# EAGLE design backplane (EAGLE 9.4.2)
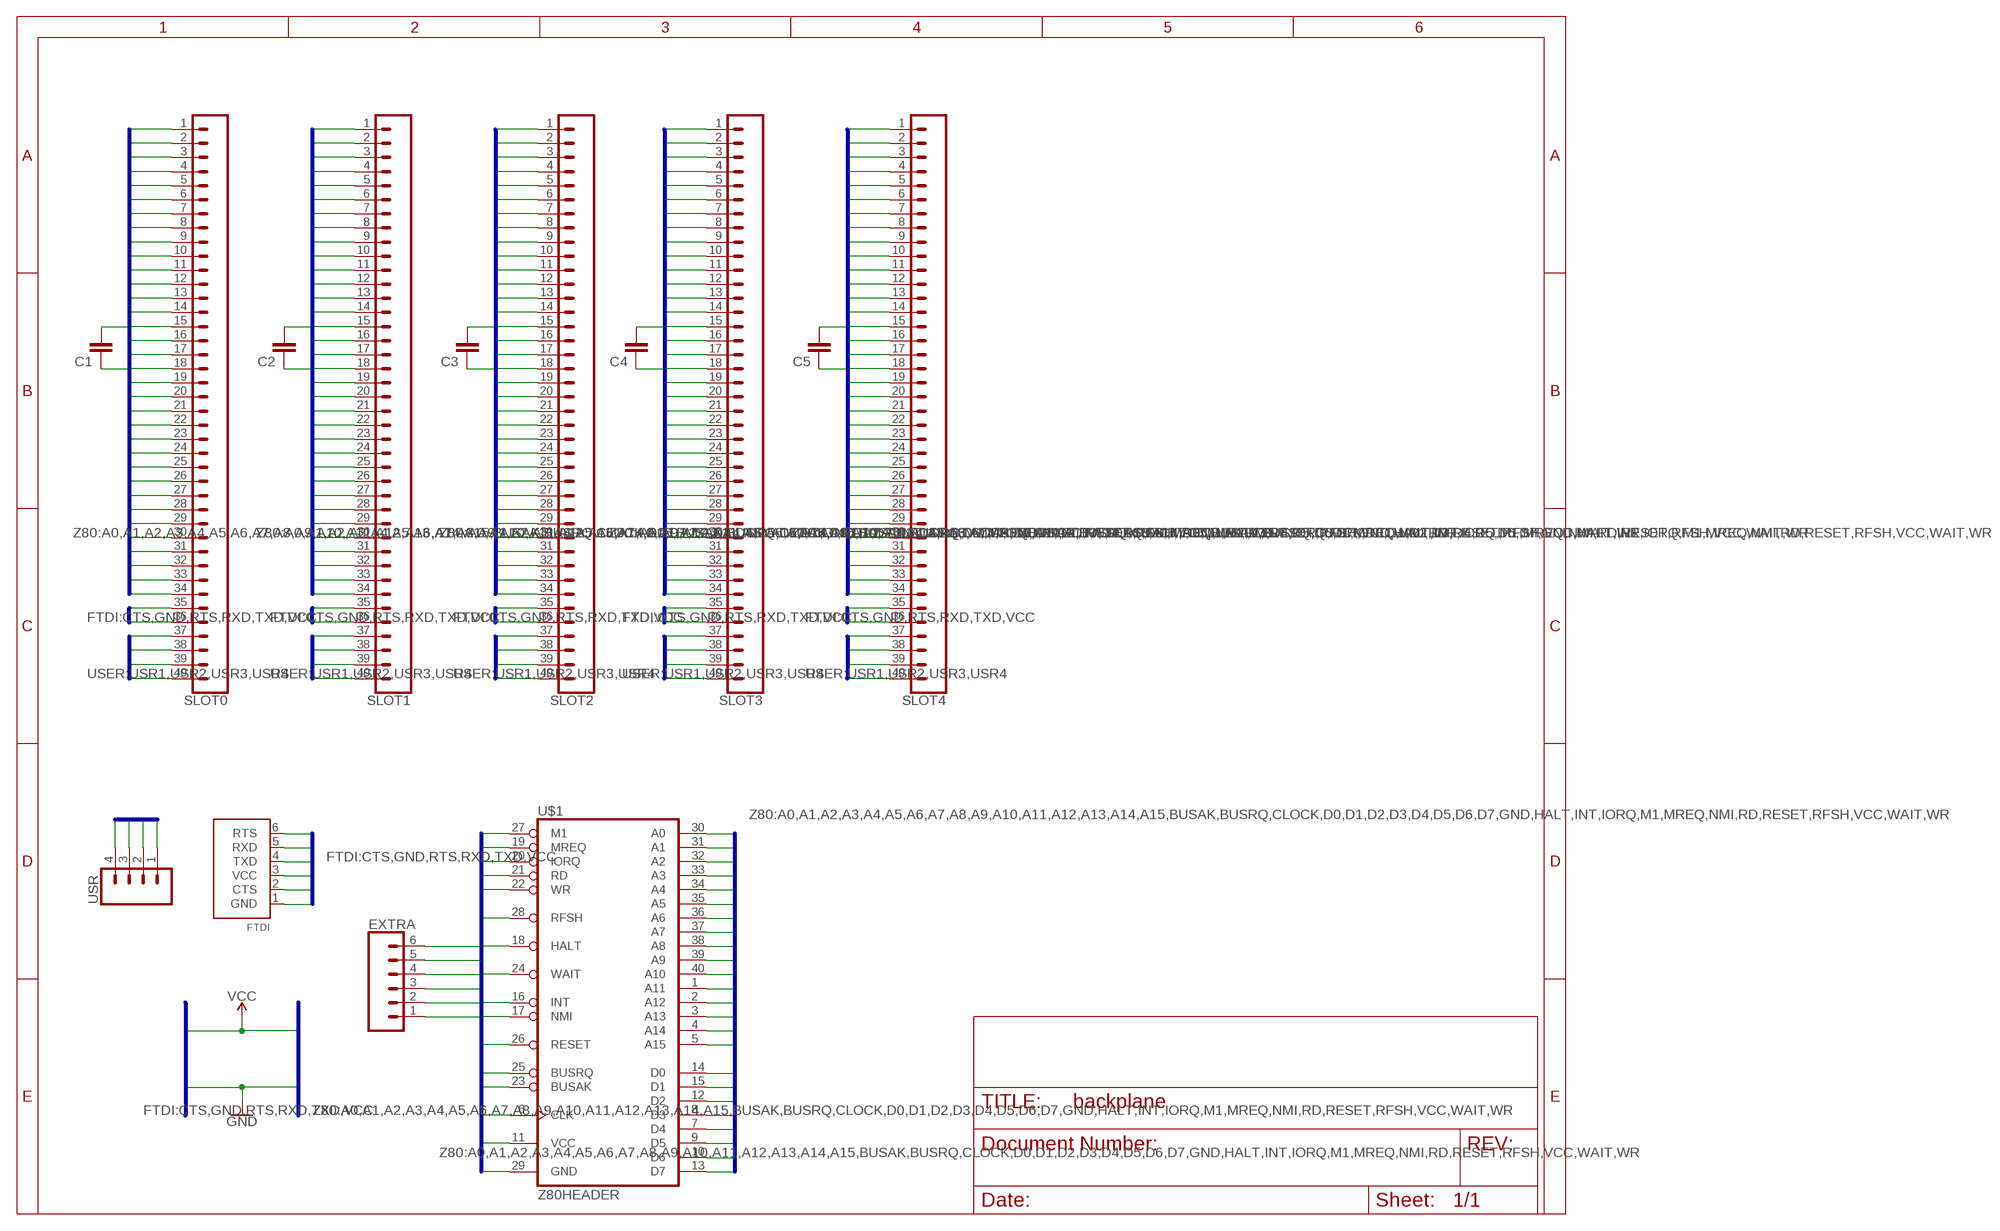
[diagram p0: schematic, sheet 1]

## Parts
C1  C2,5-3  [C2.5-3]
C2  C2,5-3  [C2.5-3]
C3  C2,5-3  [C2.5-3]
C4  C2,5-3  [C2.5-3]
C5  C2,5-3  [C2.5-3]
EXTRA  CONN_06LOCK  [1X06_LOCK]
FTDI  FTDIUSBCABLE  [1X06_ROUND]
SLOT0  CONN_40  [1X40]
SLOT1  CONN_40  [1X40]
SLOT2  CONN_40  [1X40]
SLOT3  CONN_40  [1X40]
SLOT4  CONN_40  [1X40]
U$1  Z80HEADER  [2X20]
USR  CONN_04PTH  [1X04]

## Nets
A0: SLOT0.16 SLOT1.16 SLOT2.16 SLOT3.16 SLOT4.16 U$1.30(A0)
A1: SLOT0.15 SLOT1.15 SLOT2.15 SLOT3.15 SLOT4.15 U$1.31(A1)
A2: SLOT0.14 SLOT1.14 SLOT2.14 SLOT3.14 SLOT4.14 U$1.32(A2)
A3: SLOT0.13 SLOT1.13 SLOT2.13 SLOT3.13 SLOT4.13 U$1.33(A3)
A4: SLOT0.12 SLOT1.12 SLOT2.12 SLOT3.12 SLOT4.12 U$1.34(A4)
A5: SLOT0.11 SLOT1.11 SLOT2.11 SLOT3.11 SLOT4.11 U$1.35(A5)
A6: SLOT0.10 SLOT1.10 SLOT2.10 SLOT3.10 SLOT4.10 U$1.36(A6)
A7: SLOT0.9 SLOT1.9 SLOT2.9 SLOT3.9 SLOT4.9 U$1.37(A7)
A8: SLOT0.8 SLOT1.8 SLOT2.8 SLOT3.8 SLOT4.8 U$1.38(A8)
A9: SLOT0.7 SLOT1.7 SLOT2.7 SLOT3.7 SLOT4.7 U$1.39(A9)
A10: SLOT0.6 SLOT1.6 SLOT2.6 SLOT3.6 SLOT4.6 U$1.40(A10)
A11: SLOT0.5 SLOT1.5 SLOT2.5 SLOT3.5 SLOT4.5 U$1.1(A11)
A12: SLOT0.4 SLOT1.4 SLOT2.4 SLOT3.4 SLOT4.4 U$1.2(A12)
A13: SLOT0.3 SLOT1.3 SLOT2.3 SLOT3.3 SLOT4.3 U$1.3(A13)
A14: SLOT0.2 SLOT1.2 SLOT2.2 SLOT3.2 SLOT4.2 U$1.4(A14)
A15: SLOT0.1 SLOT1.1 SLOT2.1 SLOT3.1 SLOT4.1 U$1.5(A15)
BUSAK: EXTRA.6 U$1.23(BUSAK)
BUSRQ: EXTRA.5 U$1.25(BUSRQ)
CLOCK: SLOT0.21 SLOT1.21 SLOT2.21 SLOT3.21 SLOT4.21 U$1.6(CLK)
CTS: FTDI.2(CTS)
D0: SLOT0.27 SLOT1.27 SLOT2.27 SLOT3.27 SLOT4.27 U$1.14(D0)
D1: SLOT0.28 SLOT1.28 SLOT2.28 SLOT3.28 SLOT4.28 U$1.15(D1)
D2: SLOT0.29 SLOT1.29 SLOT2.29 SLOT3.29 SLOT4.29 U$1.12(D2)
D3: SLOT0.30 SLOT1.30 SLOT2.30 SLOT3.30 SLOT4.30 U$1.8(D3)
D4: SLOT0.31 SLOT1.31 SLOT2.31 SLOT3.31 SLOT4.31 U$1.7(D4)
D5: SLOT0.32 SLOT1.32 SLOT2.32 SLOT3.32 SLOT4.32 U$1.9(D5)
D6: SLOT0.33 SLOT1.33 SLOT2.33 SLOT3.33 SLOT4.33 U$1.10(D6)
D7: SLOT0.34 SLOT1.34 SLOT2.34 SLOT3.34 SLOT4.34 U$1.13(D7)
GND: C1.1 C2.1 C3.1 C4.1 C5.1 FTDI.1(GND) SLOT0.17 SLOT1.17 SLOT2.17 SLOT3.17 SLOT4.17 U$1.29(GND)
HALT: EXTRA.3 U$1.18(HALT)
INT: SLOT0.22 SLOT1.22 SLOT2.22 SLOT3.22 SLOT4.22 U$1.16(INT)
IORQ: SLOT0.26 SLOT1.26 SLOT2.26 SLOT3.26 SLOT4.26 U$1.20(IORQ)
M1: SLOT0.19 SLOT1.19 SLOT2.19 SLOT3.19 SLOT4.19 U$1.27(M1)
MREQ: SLOT0.23 SLOT1.23 SLOT2.23 SLOT3.23 SLOT4.23 U$1.19(MREQ)
NMI: EXTRA.2 U$1.17(NMI)
RD: SLOT0.25 SLOT1.25 SLOT2.25 SLOT3.25 SLOT4.25 U$1.21(RD)
RESET: SLOT0.20 SLOT1.20 SLOT2.20 SLOT3.20 SLOT4.20 U$1.26(RESET)
RFSH: EXTRA.1 U$1.28(RFSH)
RTS: FTDI.6(RTS)
RXD: FTDI.5(RXD) SLOT0.36 SLOT1.36 SLOT2.36 SLOT3.36 SLOT4.36
TXD: FTDI.4(TXD) SLOT0.35 SLOT1.35 SLOT2.35 SLOT3.35 SLOT4.35
USR1: SLOT0.37 SLOT1.37 SLOT2.37 SLOT3.37 SLOT4.37 USR.1
USR2: SLOT0.38 SLOT1.38 SLOT2.38 SLOT3.38 SLOT4.38 USR.2
USR3: SLOT0.39 SLOT1.39 SLOT2.39 SLOT3.39 SLOT4.39 USR.3
USR4: SLOT0.40 SLOT1.40 SLOT2.40 SLOT3.40 SLOT4.40 USR.4
VCC: C1.2 C2.2 C3.2 C4.2 C5.2 FTDI.3(VCC) SLOT0.18 SLOT1.18 SLOT2.18 SLOT3.18 SLOT4.18 U$1.11(VCC)
WAIT: EXTRA.4 U$1.24(WAIT)
WR: SLOT0.24 SLOT1.24 SLOT2.24 SLOT3.24 SLOT4.24 U$1.22(WR)

## Buses
Z80:A0,A1,A2,A3,A4,A5,A6,A7,A8,A9,A10,A11,A12,A13,A14,A15,BUSAK,BUSRQ,CLOCK,D0,D1,D2,D3,D4,D5,D6,D7,GND,HALT,INT,IORQ,M1,MREQ,NMI,RD,RESET,RFSH,VCC,WAIT,WR
FTDI:CTS,GND,RTS,RXD,TXD,VCC
USER:USR1,USR2,USR3,USR4

## Library data of the parts
C1-C5 = capacitor-wima:C: CAPACITOR naming: grid - package width
EXTRA = SparkFun-Connectors:CONN_06: Multi connection point. Often used as Generic Header-pin footprint for 0.1 inch spaced/style header connections On any of the 0.1 inch spaced packages, you can populate with these: Break Away Headers - Straight <https://www.sparkfun.com/products/116> (PRT-00116) Break Away Male Headers - Right Angle <https://www.sparkfun.com/products/553> (PRT-00553) Female Headers <https://www.sparkfun.com/products/115> (PRT-00115) Break Away Headers - Machine Pin <https://www.sparkfun.com/products/117> (PRT-00117) Break Away Female Headers - Swiss Machine Pin <https://www.sparkfun.com/products/743> (PRT-00743) Arduino Stackable Header - 6 Pin <https://www.sparkfun.com/products/9280> (PRT-09280) For SCREWTERMINALS and SPRING TERMINALS visit here: Screw Terimnals on SparkFun.com <https://www.sparkfun.com/search/results?term=Screw+Terminals> (5mm/3.5mm/2.54mm spacing) This device is also useful as a general connection point to wire up your design to another part of your project. Our various solder wires solder well into these plated through hole pads. Hook-Up Wire - Assortment (Stranded, 22 AWG) <https://www.sparkfun.com/products/11375> (PRT-11375) Hook-Up Wire - Assortment (Solid Core, 22 AWG) <https://www.sparkfun.com/products/11367> (PRT-11367) View the entire wire category on our website here <https://www.sparkfun.com/categories/141>
FTDI = microbuilder:FTDIUSBCABLE: FTDI TTL-232R USB Cable Connector for FTDI's USB->RS232 Cable
SLOT0 SLOT1-SLOT4 = SparkFun-Connectors:CONN_40: Multi connection point. Often used as Generic Header-pin footprint for 0.1 inch spaced/style header connections On any of the 0.1 inch spaced packages, you can populate with these: Break Away Headers - Straight <https://www.sparkfun.com/products/116> (PRT-00116) Break Away Male Headers - Right Angle <https://www.sparkfun.com/products/553> (PRT-00553) Female Headers <https://www.sparkfun.com/products/115> (PRT-00115) Break Away Headers - Machine Pin <https://www.sparkfun.com/products/117> (PRT-00117) Break Away Female Headers - Swiss Machine Pin <https://www.sparkfun.com/products/743> (PRT-00743) For SCREWTERMINALS and SPRING TERMINALS visit here: Screw Terimnals on SparkFun.com <https://www.sparkfun.com/search/results?term=Screw+Terminals> (5mm/3.5mm/2.54mm spacing) This device is also useful as a general connection point to wire up your design to another part of your project. Our various solder wires solder well into these plated through hole pads. Hook-Up Wire - Assortment (Stranded, 22 AWG) <https://www.sparkfun.com/products/11375> (PRT-11375) Hook-Up Wire - Assortment (Solid Core, 22 AWG) <https://www.sparkfun.com/products/11367> (PRT-11367) View the entire wire category on our website here <https://www.sparkfun.com/categories/141> Special notes: Molex polarized connector foot print use with SKU : PRT-08231 with associated crimp pins and housings. 1MM SMD Version SKU: PRT-10208 NOTES ON THE VARIANTS LOCK and LOCK_LONGPADS... This footprint was designed to help hold the alignment of a through-hole component (i.e. 6-pin header) while soldering it into place. You may notice that each hole has been shifted either up or down by 0.005 of an inch from it's more standard position (which is a perfectly straight line). This slight alteration caused the pins (the squares in the middle) to touch the edges of the holes. Because they are alternating, it causes a "brace" to hold the component in place. 0.005 has proven to be the perfect amount of "off-center" position when using our standard breakaway headers. Although looks a little odd when you look at the bare footprint, once you have a header in there, the alteration is very hard to notice. Also,if you push a header all the way into place, it is covered up entirely on the bottom side.
U$1 = wntrmute:Z80
USR = SparkFun-Connectors:CONN_04: Multi connection point. Often used as Generic Header-pin footprint for 0.1 inch spaced/style header connections On any of the 0.1 inch spaced packages, you can populate with these: Break Away Headers - Straight <https://www.sparkfun.com/products/116> (PRT-00116) Break Away Male Headers - Right Angle <https://www.sparkfun.com/products/553> (PRT-00553) Female Headers <https://www.sparkfun.com/products/115> (PRT-00115) Break Away Headers - Machine Pin <https://www.sparkfun.com/products/117> (PRT-00117) Break Away Female Headers - Swiss Machine Pin <https://www.sparkfun.com/products/743> (PRT-00743) For SCREWTERMINALS and SPRING TERMINALS visit here: Screw Terimnals on SparkFun.com <https://www.sparkfun.com/search/results?term=Screw+Terminals> (5mm/3.5mm/2.54mm spacing) This device is also useful as a general connection point to wire up your design to another part of your project. Our various solder wires solder well into these plated through hole pads. Hook-Up Wire - Assortment (Stranded, 22 AWG) <https://www.sparkfun.com/products/11375> (PRT-11375) Hook-Up Wire - Assortment (Solid Core, 22 AWG) <https://www.sparkfun.com/products/11367> (PRT-11367) View the entire wire category on our website here <https://www.sparkfun.com/categories/141> Special notes: Molex polarized connector foot print use with SKU : PRT-08231 with associated crimp pins and housings. 1MM SMD Version SKU: PRT-10208; PROD_ID: CONN-09696

## Net classes
0 default: width 0.152 mm, drill 0.254 mm, clearance 0.152 mm

## Board
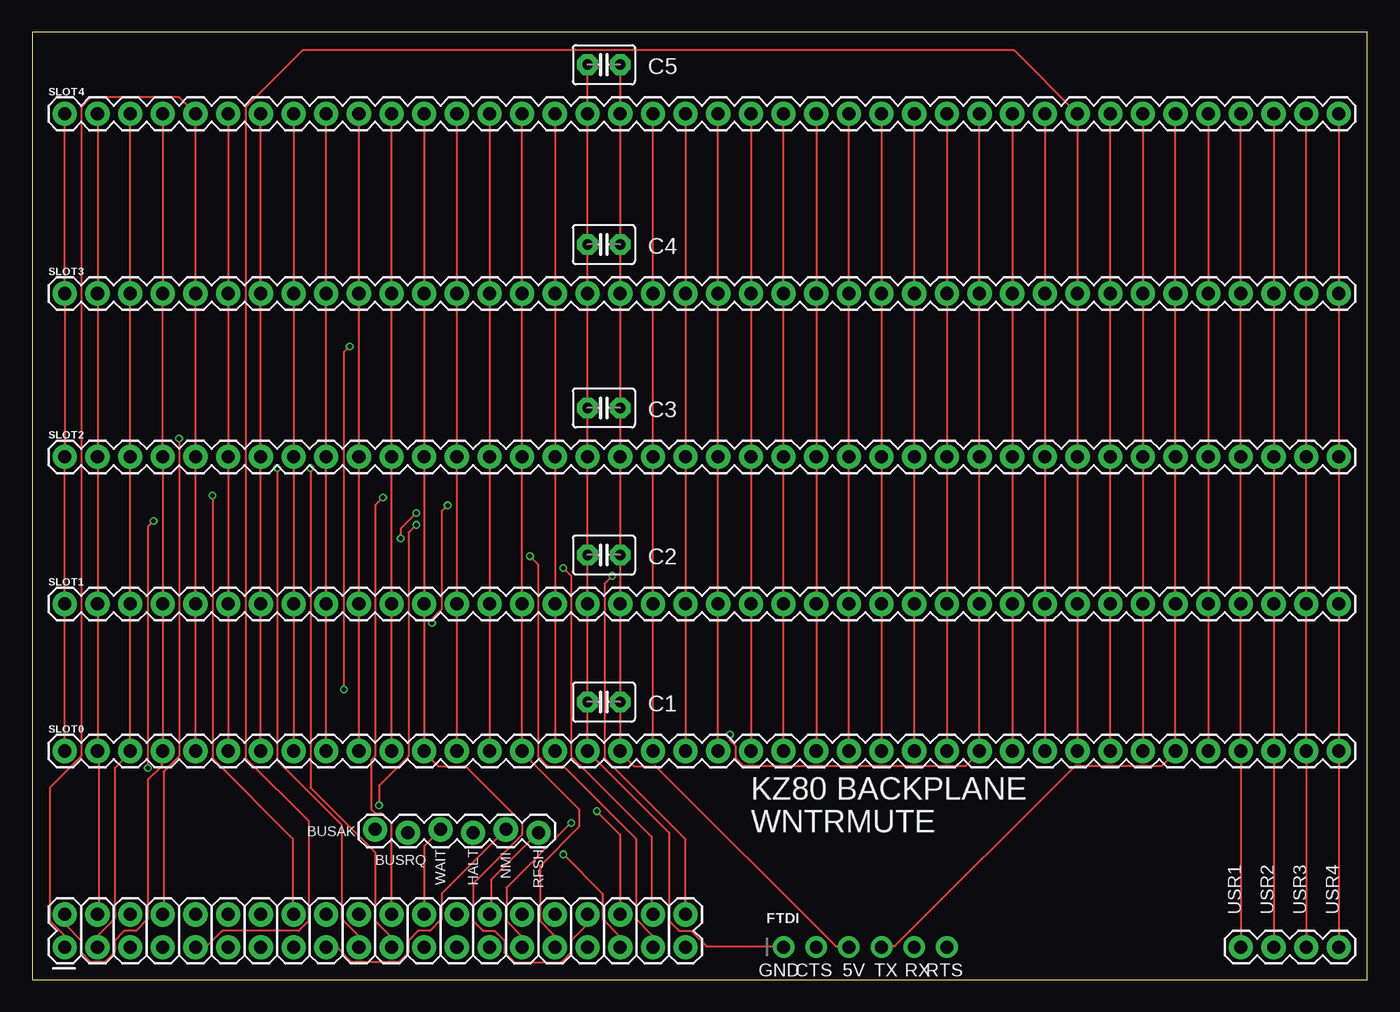
[diagram p1: board, top side]
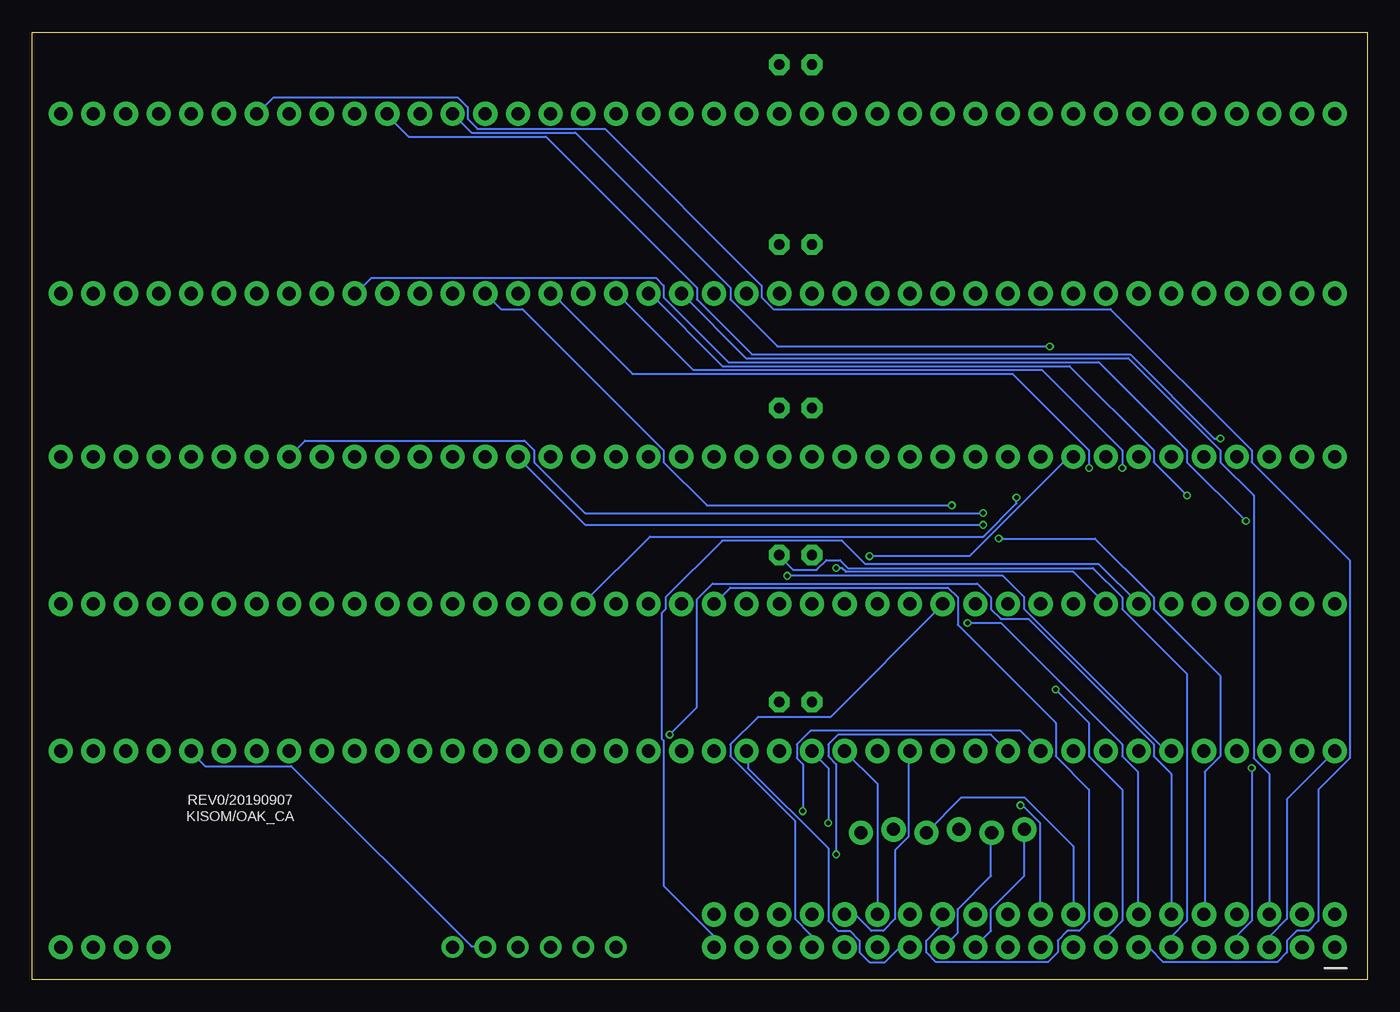
[diagram p2: board, bottom side, seen from below]

Size 103.81 x 73.65 mm. Coordinates in mm from the lower left corner, seen from the top.
Outline: 0,0 103.81,0 103.81,73.65 0,73.65 0,0
Copper layers (1*16): Top 0.035559375mm / dielectric 1.6mm / Bottom 0.035559375mm
Design rules "oshpark-2layer": minimum track width 6mil, minimum drill 10mil, track to track 6mil, track to pad 6mil, pad to pad 6mil, via to via 6mil, smd to smd 6mil, copper to edge 15mil, drill to drill 6mil, minimum pad ring 5mil, minimum via ring 5mil, stop-mask expansion 2.5mil, vias tented up to drill 0mil, thermal gap 10mil

### Footprints (pad centres in the part's own frame; a part is rotated, then mirrored left to right if it is on the bottom)
C2.5-3 = drill 0.813 pad 1.6 octagon: 1 -1.27,0; 2 1.27,0
1X06_LOCK = drill 1.016 pad 1.88: 1 0,0; 2 2.54,-0.254; 3 5.08,0; 4 7.62,-0.254; 5 10.16,0; 6 12.7,-0.254
1X06_ROUND = drill 1 pad 1.676: 1 -6.35,0; 2 -3.81,0; 3 -1.27,0; 4 1.27,0; 5 3.81,0; 6 6.35,0
1X40 = drill 1.016 pad 1.88: 1 0,0; 2 2.54,0; 3 5.08,0; 4 7.62,0; 5 10.16,0; 6 12.7,0; 7 15.24,0; 8 17.78,0; 9 20.32,0; 10 22.86,0; 11 25.4,0; 12 27.94,0; 13 30.48,0; 14 33.02,0; 15 35.56,0; 16 38.1,0; 17 40.64,0; 18 43.18,0; 19 45.72,0; 20 48.26,0; 21 50.8,0; 22 53.34,0; 23 55.88,0; 24 58.42,0; 25 60.96,0; 26 63.5,0; 27 66.04,0; 28 68.58,0; 29 71.12,0; 30 73.66,0; 31 76.2,0; 32 78.74,0; 33 81.28,0; 34 83.82,0; 35 86.36,0; 36 88.9,0; 37 91.44,0; 38 93.98,0; 39 96.52,0; 40 99.06,0
2X20 = drill 1.016 pad 1.88: 1 0,0; 2 0,2.54; 3 2.54,0; 4 2.54,2.54; 5 5.08,0; 6 5.08,2.54; 7 7.62,0; 8 7.62,2.54; 9 10.16,0; 10 10.16,2.54; 11 12.7,0; 12 12.7,2.54; 13 15.24,0; 14 15.24,2.54; 15 17.78,0; 16 17.78,2.54; 17 20.32,0; 18 20.32,2.54; 19 22.86,0; 20 22.86,2.54; 21 25.4,0; 22 25.4,2.54; 23 27.94,0; 24 27.94,2.54; 25 30.48,0; 26 30.48,2.54; 27 33.02,0; 28 33.02,2.54; 29 35.56,0; 30 35.56,2.54; 31 38.1,0; 32 38.1,2.54; 33 40.64,0; 34 40.64,2.54; 35 43.18,0; 36 43.18,2.54; 37 45.72,0; 38 45.72,2.54; 39 48.26,0; 40 48.26,2.54
1X04 = drill 1.016 pad 1.88: 1 0,0; 2 2.54,0; 3 5.08,0; 4 7.62,0

### Placement (x,y rotation side)
C1  44.45,21.59 0 top
C2  44.45,33.02 0 top
C3  44.45,44.45 0 top
C4  44.45,57.15 0 top
C5  44.45,71.12 0 top
EXTRA  39.37,11.43 180 top
FTDI  64.77,2.54 0 top
SLOT0  2.54,17.78 0 top
SLOT1  2.54,29.21 0 top
SLOT2  2.54,40.64 0 top
SLOT3  2.54,53.34 0 top
SLOT4  2.54,67.31 0 top
U$1  2.54,2.54 0 top
USR  93.98,2.54 0 top

### Tracks (layer width: path | path; a pad name or v marks a point on that pad's centre or on a via)
A0
  Top 0.152: SLOT4.16 SLOT3.16 SLOT2.16 SLOT1.16 SLOT0.16
  Bottom 0.152: U$1.30 38.1,15.24 SLOT0.16
A1
  Top 0.152: SLOT4.15 SLOT3.15 SLOT2.15 SLOT1.15 SLOT0.15 38.1,17.68 42.52,13.26 42.52,11.89 39.47,8.84 39.47,4.57 40.54,3.5 40.54,2.59 U$1.31
A2
  Top 0.152: SLOT4.14 SLOT3.14 SLOT2.14 SLOT1.14 SLOT0.14
  Bottom 0.152: U$1.32 40.54,5.03 39.78,5.03 38.56,3.81 37.64,3.81 36.73,4.72 36.73,10.06 35.66,11.12 35.66,17.68 SLOT0.14
A3
  Top 0.152: SLOT0.13 SLOT1.13 SLOT2.13 SLOT3.13 SLOT4.13
  Bottom 0.152: U$1.33 43.28,2.59 43.28,3.5 44.5,4.72 44.5,12.34 49.53,17.37 49.53,18.29 47.4,20.42 41.76,20.42 33.07,29.11 SLOT1.13
A4
  Top 0.152: SLOT4.12 SLOT3.12 SLOT2.12 SLOT1.12 SLOT0.12 30.48,17.68 31.55,16.61 33.68,16.61 38.1,12.19 38.1,11.28 34.29,7.47 34.29,4.57 35.05,3.81 35.97,3.81 36.73,3.05 36.73,2.13 37.49,1.37 41.15,1.37 41.91,2.13 41.91,3.05 43.13,4.27 43.13,5.03 U$1.34
A5  (via drill 0.35)
  Top 0.152: SLOT0.11 SLOT1.11 SLOT2.11 SLOT3.11 SLOT4.11 | U$1.35 45.72,3.35 44.35,4.72 44.35,6.71 v41.3,9.75
  Bottom 0.152: v41.3,9.75 41.3,16.76 41.91,17.37 41.91,18.29 41.15,19.05 29.26,19.05 28.04,17.83 SLOT0.11
A6  (via drill 0.35)
  Top 0.152: SLOT4.10 SLOT3.10 SLOT2.10 SLOT1.10 SLOT0.10 | U$1.36 45.72,11.28 v43.89,13.11
  Bottom 0.152: v43.89,13.11 43.89,16.76 44.35,17.22 44.35,18.29 43.28,19.36 26.98,19.36 SLOT0.10
A7  (via drill 0.35)
  Top 0.152: SLOT0.9 SLOT1.9 SLOT2.9 SLOT3.9 SLOT4.9 | v38.71,32.92 39.32,32.31 39.32,17.37 40.08,16.61 41.3,16.61 46.94,10.97 46.94,4.72 48.16,3.5 48.16,2.59 U$1.37
  Bottom 0.152: v38.71,32.92 30.94,32.92 23.32,40.54 22.86,40.54 SLOT2.9
A8  (via drill 0.35)
  Top 0.152: SLOT4.8 SLOT3.8 SLOT2.8 SLOT1.8 SLOT0.8 | v41.3,32 41.91,31.39 41.91,17.37 48.16,11.12 48.16,5.18 U$1.38
  Bottom 0.152: v41.3,32 40.84,32 40.54,31.7 22.86,31.7 20.42,29.26 SLOT1.8
A9
  Top 0.152: SLOT0.7 SLOT1.7 SLOT2.7 SLOT3.7 SLOT4.7
  Bottom 0.152: SLOT1.7 20.88,32.31 39.01,32.31 40.84,34.14 50.14,34.14 54.56,29.72 54.56,28.8 54.86,28.5 54.86,18.75 54.71,18.59 54.71,7.32 50.9,3.5 50.9,2.59 U$1.39
A10  (via drill 0.35)
  Top 0.152: SLOT4.6 SLOT3.6 SLOT2.6 SLOT1.6 SLOT0.6 | v45.11,31.39 44.5,30.79 44.5,17.22 50.75,10.97 50.75,5.18 U$1.40
  Bottom 0.152: v45.11,31.39 28.35,31.39 26.67,29.72 26.67,28.8 15.7,17.83 15.24,17.83 SLOT0.6
A11
  Top 0.152: SLOT0.5 SLOT1.5 SLOT2.5 SLOT3.5 SLOT4.5 11.43,68.58 4.57,68.58 3.81,67.82 3.81,17.37 1.37,14.94 1.37,4.57 2.44,3.5 2.44,2.59 U$1.1
A12
  Top 0.152: SLOT4.4 SLOT3.4 SLOT2.4 SLOT1.4 SLOT0.4 10.06,17.68 10.06,16.61 8.99,15.54 8.99,4.72 8.08,3.81 7.16,3.81 6.4,3.05 6.4,2.13 5.64,1.37 4.57,1.37 3.81,2.13 3.81,3.05 2.59,4.27 2.59,5.03 U$1.2
A13
  Top 0.152: SLOT4.3 SLOT3.3 SLOT2.3 SLOT1.3 SLOT0.3 7.62,17.68 6.4,16.46 6.4,4.72 5.18,3.5 5.18,2.59 U$1.3
A14
  Top 0.152: SLOT4.2 SLOT3.2 SLOT2.2 SLOT1.2 SLOT0.2 5.18,17.68 5.18,5.18 U$1.4
A15
  Top 0.152: SLOT0.1 SLOT1.1 SLOT2.1 SLOT3.1 SLOT4.1
  Bottom 0.152: U$1.5 7.62,3.35 6.25,4.72 6.25,14.02 2.59,17.68 SLOT0.1
BUSAK
  Bottom 0.152: EXTRA.6 26.67,8.08 29.26,5.49 29.26,3.81 30.48,2.59 U$1.23
BUSRQ
  Bottom 0.152: EXTRA.5 29.26,11.43 29.26,8.08 31.85,5.49 31.85,3.66 32.92,2.59 U$1.25
CLOCK
  Top 0.152: SLOT0.21 SLOT1.21 SLOT2.21 SLOT3.21 SLOT4.21
  Bottom 0.152: U$1.6 7.62,16 8.84,17.22 8.84,37.64 11.43,40.23 11.43,41.15 18.59,48.31 48.31,48.31 SLOT3.21
D0  (via drill 0.35)
  Top 0.152: SLOT0.27 SLOT1.27 SLOT2.27 SLOT3.27 SLOT4.27 | v31.09,27.74 31.09,28.04 31.85,28.8 31.85,36.42 v32.31,36.88
  Bottom 0.152: v31.09,27.74 28.5,27.74 19.05,18.29 19.05,17.37 17.83,16.15 17.83,5.18 U$1.14 | v32.31,36.88 51.36,36.88 54.71,40.23 54.71,41.15 65.68,52.12 67.36,52.12 SLOT3.27
D1  (via drill 0.35)
  Top 0.152: SLOT4.28 SLOT3.28 SLOT2.28 SLOT1.28 SLOT0.28 | v24.23,22.55 24.23,48.77 v24.69,49.23
  Bottom 0.152: v24.23,22.55 21.64,19.96 21.64,17.37 19.05,14.78 19.05,4.57 20.27,3.35 20.27,2.59 U$1.15 | v24.69,49.23 45.87,49.23 49.53,52.88 49.53,53.8 61.57,65.84 69.65,65.84 SLOT4.28
D2  (via drill 0.35)
  Top 0.152: SLOT4.29 SLOT3.29 SLOT2.29 SLOT1.29 SLOT0.29 73.61,17.68 72.54,16.61 55.32,16.61 54.71,17.22 54.71,18.14 54.25,18.59 v54.25,19.05
  Bottom 0.152: U$1.12 15.24,16 16.61,17.37 16.61,18.29 26.36,28.04 28.5,28.04 29.26,28.8 29.26,29.72 30.33,30.79 50.9,30.79 52.12,29.57 52.12,21.18 v54.25,19.05
D3  (via drill 0.35)
  Top 0.152: SLOT4.30 SLOT3.30 SLOT2.30 SLOT1.30 SLOT0.30 | v11.43,42.06 11.43,17.37 10.21,16.15 10.21,5.18 U$1.8
  Bottom 0.152: v11.43,42.06 11.89,42.06 18.44,48.62 47.85,48.62 52.12,52.88 52.12,53.8 63.86,65.53 74.52,65.53 76.2,67.21 SLOT4.30
D4  (via drill 0.35)
  Top 0.152: SLOT4.31 SLOT3.31 SLOT2.31 SLOT1.31 SLOT0.31 | v8.99,16.46 8.99,35.2 v9.45,35.66
  Bottom 0.152: v8.99,16.46 8.99,4.57 10.06,3.5 10.06,2.59 U$1.7 | v9.45,35.66 14.02,40.23 14.02,41.15 20.88,48.01 49.68,48.01 54.71,53.03 54.71,53.95 55.32,54.56 77.42,54.56 78.64,53.34 SLOT3.31
D5
  Top 0.152: SLOT0.32 SLOT1.32 SLOT2.32 SLOT3.32 SLOT4.32 76.35,72.24 21.03,72.24 16.61,67.82 16.61,17.22 21.49,12.34 21.49,4.57 20.73,3.81 14.78,3.81 13.56,2.59 12.8,2.59 U$1.9
D6  (via drill 0.35)
  Top 0.152: SLOT0.33 SLOT1.33 SLOT2.33 SLOT3.33 SLOT4.33 | v28.65,34.29 28.65,35.05 v29.87,36.27
  Bottom 0.152: v28.65,34.29 21.18,34.29 16.61,29.72 16.61,28.8 11.43,23.62 11.43,17.37 12.65,16.15 12.65,5.18 U$1.10 | v29.87,36.27 60.81,36.27 64.77,40.23 64.77,41.15 65.53,41.91 82.6,41.91 83.82,40.69 SLOT2.33
D7
  Top 0.152: SLOT4.34 SLOT3.34 SLOT2.34 SLOT1.34 SLOT0.34
  Bottom 0.152: U$1.13 17.68,2.44 16.92,2.44 15.85,1.37 7.01,1.37 6.25,2.13 6.25,3.05 5.49,3.81 4.57,3.81 3.81,4.57 3.81,14.78 1.37,17.22 1.37,32.61 8.99,40.23 8.99,41.15 19.96,52.12 46.18,52.12 47.09,53.03 47.09,53.95 59.28,66.14 69.19,66.14 69.95,66.9 69.95,67.82 70.71,68.58 85.04,68.58 86.26,67.36 SLOT4.34
GND  (via drill 0.35)
  Top 0.152: C5.1 SLOT4.17 C4.1 SLOT3.17 C3.1 SLOT2.17 C2.1 SLOT1.17 C1.1 SLOT0.17 49.53,11.43 49.53,4.57 50.29,3.81 51.21,3.81 52.43,2.59 58.37,2.59 FTDI.1 | U$1.29 38.1,3.35 36.88,4.57 36.88,7.16 v41.91,12.19
  Bottom 0.152: v41.91,12.19 41.91,16.46 43.13,17.68 SLOT0.17
HALT
  Bottom 0.152: U$1.18 22.86,10.36 26.67,14.17 31.55,14.17 EXTRA.3
INT  (via drill 0.35)
  Top 0.152: SLOT4.22 SLOT3.22 SLOT2.22 SLOT1.22 SLOT0.22 | v14.02,37.64 14.02,17.22 20.27,10.97 20.27,5.18 U$1.16
  Bottom 0.152: v14.02,37.64 16.61,40.23 16.61,41.15 23.16,47.7 50.14,47.7 55.78,53.34 SLOT3.22
IORQ  (via drill 0.35)
  Top 0.152: SLOT4.26 SLOT3.26 SLOT2.26 SLOT1.26 SLOT0.26 | v26.98,13.56 26.98,15.09 29.26,17.37 29.26,34.75 v29.87,35.36
  Bottom 0.152: v26.98,13.56 26.82,13.56 25.45,12.19 25.45,5.18 U$1.20 | v29.87,35.36 60.81,35.36 65.99,40.54 SLOT2.26
M1
  Top 0.152: SLOT0.19 SLOT1.19 SLOT2.19 SLOT3.19 SLOT4.19
  Bottom 0.152: U$1.27 35.66,2.44 36.42,2.44 37.49,1.37 38.71,1.37 39.47,2.13 39.47,3.05 40.23,3.81 41.15,3.81 41.91,4.57 41.91,10.21 48.16,16.46 48.16,17.68 SLOT0.19
MREQ  (via drill 0.35)
  Top 0.152: SLOT0.23 SLOT1.23 SLOT2.23 SLOT3.23 SLOT4.23 | v19.05,39.78 19.05,17.07 24.08,12.04 24.08,4.72 25.3,3.5 25.3,2.59 U$1.19
  Bottom 0.152: v19.05,39.78 19.05,41.15 25.3,47.4 52.43,47.4 58.37,53.34 SLOT3.23
NMI
  Top 0.152: EXTRA.2 31.85,6.71 31.85,4.72 30.94,3.81 30.02,3.81 29.26,3.05 29.26,2.13 28.5,1.37 24.84,1.37 23.77,2.44 22.86,2.44 U$1.17
RD  (via drill 0.35)
  Top 0.152: SLOT0.25 SLOT1.25 SLOT2.25 SLOT3.25 SLOT4.25 | v21.64,39.78 21.64,14.94 26.67,9.91 26.67,4.57 27.89,3.35 27.89,2.59 U$1.21
  Bottom 0.152: v21.64,39.78 21.64,41.15 27.58,47.09 57.15,47.09 63.4,53.34 SLOT3.25
RESET
  Top 0.152: SLOT4.20 SLOT3.20 SLOT2.20 SLOT1.20 SLOT0.20
  Bottom 0.152: SLOT1.20 49.53,30.48 32.61,30.48 31.85,29.72 31.85,27.58 24.23,19.96 24.23,17.37 21.64,14.78 21.64,4.57 22.4,3.81 23.32,3.81 24.08,3.05 24.08,2.13 24.84,1.37 33.53,1.37 34.29,2.13 34.29,3.05 33.07,4.27 33.07,5.03 U$1.26
RFSH
  Top 0.152: U$1.28 35.66,5.18 35.66,7.77 39.32,11.43 EXTRA.1
RXD
  Top 0.152: SLOT4.36 SLOT3.36 SLOT2.36 SLOT1.36 SLOT0.36
  Bottom 0.152: FTDI.5 68.58,2.59 69.65,2.59 83.67,16.61 90.37,16.61 91.44,17.68 SLOT0.36
TXD
  Top 0.152: SLOT4.35 SLOT3.35 SLOT2.35 SLOT1.35 SLOT0.35 88.85,17.68 87.78,16.61 81.08,16.61 67.06,2.59 66.14,2.59 FTDI.4
USR1
  Top 0.152: SLOT4.37 SLOT3.37 SLOT2.37 SLOT1.37 SLOT0.37 USR.1
USR2
  Top 0.152: SLOT4.38 SLOT3.38 SLOT2.38 SLOT1.38 SLOT0.38 USR.2
USR3
  Top 0.152: SLOT4.39 SLOT3.39 SLOT2.39 SLOT1.39 SLOT0.39 USR.3
USR4
  Top 0.152: SLOT4.40 SLOT3.40 SLOT2.40 SLOT1.40 SLOT0.40 USR.4
VCC
  Top 0.152: C5.2 SLOT4.18 C4.2 SLOT3.18 C3.2 SLOT2.18 C2.2 SLOT1.18 C1.2 SLOT0.18 45.72,17.68 46.79,16.61 48.46,16.61 62.48,2.59 63.4,2.59 FTDI.3
  Bottom 0.152: U$1.11 15.24,3.35 14.02,4.57 14.02,23.77 19.05,28.8 19.05,29.72 21.34,32 40.39,32 41,32.61 42.06,32.61 42.82,31.85 44.65,31.85 45.72,32.92 C2.2
WAIT
  Top 0.152: U$1.24 30.48,10.36 31.7,11.58 EXTRA.4
WR  (via drill 0.35)
  Top 0.152: SLOT4.24 SLOT3.24 SLOT2.24 SLOT1.24 SLOT0.24 | v27.28,37.49 26.67,36.88 26.67,17.37 26.36,17.07 26.36,13.26 26.67,12.95 27.13,12.95 27.89,12.19 27.89,5.18 U$1.22
  Bottom 0.152: v27.28,37.49 27.28,37.03 29.87,34.44 55.78,34.44 60.96,29.26 SLOT1.24

### Text on the board
tPlace: KZ80 BACKPLANE | BUSAK | WNTRMUTE | BUSRQ | WAIT | HALT | NMI | RFSH | USR1 | USR2 | USR3 | USR4 | GND | CTS | 5V | TX | RX | RTS
bPlace: REV0/20190907 | KISOM/OAK_CA